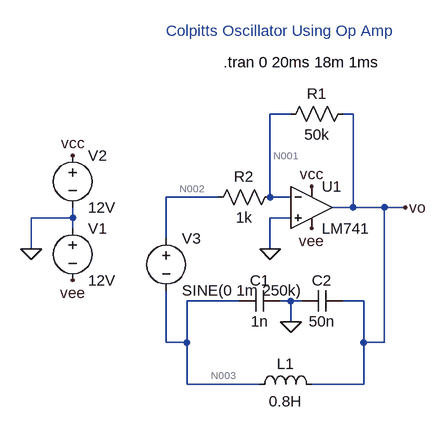
[diagram p0: schematic colpitts_using_opamp.asc]
colpitts_using_opamp.asc, the LTspice schematic file:
Version 4.1
SHEET 1 880 680
WIRE 304 16 272 16
WIRE 400 16 384 16
WIRE 192 144 112 144
WIRE 272 144 272 16
WIRE 304 144 272 144
WIRE 400 160 400 16
WIRE 400 160 368 160
WIRE 448 160 400 160
WIRE 480 160 448 160
WIRE -32 176 -32 160
WIRE -32 176 -96 176
WIRE 304 176 272 176
WIRE -32 192 -32 176
WIRE 112 208 112 144
WIRE -96 224 -96 176
WIRE 272 224 272 176
WIRE 224 304 144 304
WIRE 304 304 288 304
WIRE 320 304 304 304
WIRE 416 304 384 304
WIRE 304 336 304 304
WIRE 112 368 112 288
WIRE 144 368 144 304
WIRE 144 368 112 368
WIRE 416 368 416 304
WIRE 448 368 448 160
WIRE 448 368 416 368
WIRE 144 432 144 368
WIRE 256 432 144 432
WIRE 416 432 416 368
WIRE 416 432 336 432
FLAG -96 224 0
FLAG -32 80 vcc
FLAG 336 128 vcc
FLAG -32 272 vee
FLAG 336 192 vee
FLAG 272 224 0
FLAG 480 160 vo
FLAG 304 336 0
SYMBOL voltage -32 176 R0
WINDOW 123 0 0 Left 0
WINDOW 39 0 0 Left 0
SYMATTR InstName V1
SYMATTR Value 12V
SYMBOL voltage -32 64 R0
WINDOW 123 0 0 Left 0
WINDOW 39 0 0 Left 0
SYMATTR InstName V2
SYMATTR Value 12V
SYMBOL LM741 336 96 R0
SYMATTR InstName U1
SYMBOL res 400 0 R90
WINDOW 0 0 56 VBottom 2
WINDOW 3 32 56 VTop 2
SYMATTR InstName R1
SYMATTR Value 50k
SYMBOL res 288 128 R90
WINDOW 0 0 56 VBottom 2
WINDOW 3 32 56 VTop 2
SYMATTR InstName R2
SYMATTR Value 1k
SYMBOL cap 288 288 R90
WINDOW 0 0 32 VBottom 2
WINDOW 3 32 32 VTop 2
SYMATTR InstName C1
SYMATTR Value 1n
SYMBOL cap 384 288 R90
WINDOW 0 0 32 VBottom 2
WINDOW 3 32 32 VTop 2
SYMATTR InstName C2
SYMATTR Value 50n
SYMBOL ind 352 448 M270
WINDOW 0 32 56 VTop 2
WINDOW 3 5 56 VBottom 2
SYMATTR InstName L1
SYMATTR Value 0.8H
SYMBOL voltage 112 192 R0
WINDOW 123 0 0 Left 0
WINDOW 39 0 0 Left 0
SYMATTR InstName V3
SYMATTR Value SINE(0 1m 250k)
TEXT 200 -64 Left 2 !.tran 0 20ms 18m 1ms
TEXT 112 -112 Left 2 ;Colpitts Oscillator Using Op Amp

The netlist it stands for:
* colpitts_using_opamp.asc
V1 0 vee 12V
V2 vcc 0 12V
X§U1 0 N001 vcc vee vo LM741  ; pins In+ In- V+ V- OUT
R1 vo N001 50k
R2 N001 N002 1k
C1 0 N003 1n
C2 vo 0 50n
L1 vo N003 0.8H
V3 N002 N003 SINE(0 1m 250k)
.tran 0 20ms 18m 1ms
* Colpitts Oscillator Using Op Amp
.lib LM741.lib
.backanno
.end

* Results of the author's LTspice run, read from the files saved beside the schematic
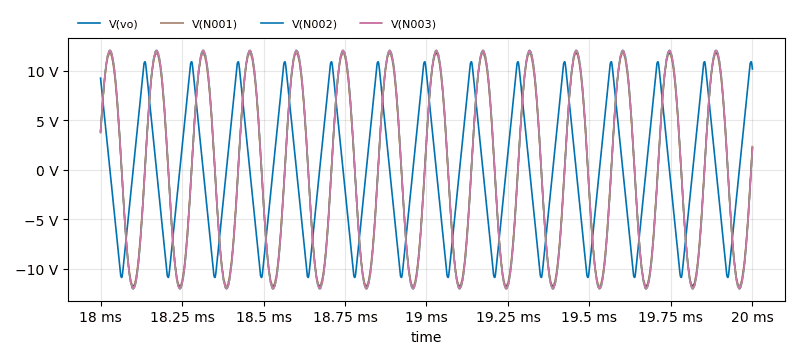
[diagram p1: Transient Analysis of colpitts_using_opamp.asc, plotted from the saved traces]
* Transient Analysis, 1 run:
*   V(vo): min -10.9 V, max 10.9 V, average -13.76 mV, rms 6.67 V, last 10.17 V
*   V(N001): min -11.78 V, max 11.79 V, average -4.424 mV, rms 8.429 V, last 2.319 V
*   V(N002): min -12.04 V, max 12.05 V, average -4.146 mV, rms 8.616 V, last 2.167 V
*   V(N003): min -12.04 V, max 12.05 V, average -4.132 mV, rms 8.616 V, last 2.167 V